# EAGLE schematic cut (EAGLE 4.11)
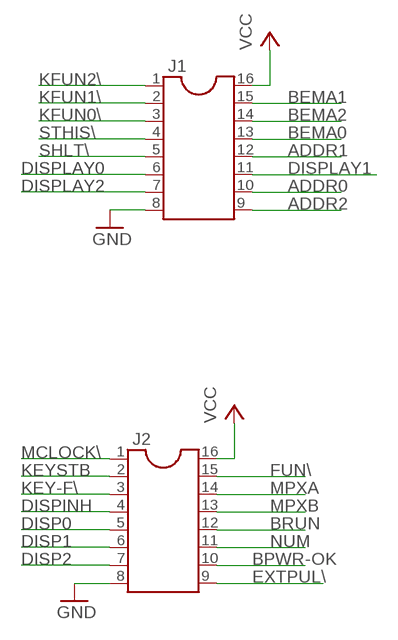
[diagram p0: schematic, sheet 1]

## Parts
J1  DIL16S  [SOCKED-16]
J2  DIL16S  [SOCKED-16]

## Nets
ADDR0: J1.10
ADDR1: J1.12
ADDR2: J1.9
BEMA0: J1.13
BEMA1: J1.15
BEMA2: J1.14
BPWR-OK: J2.10
BRUN: J2.12
DISP0: J2.5
DISP1: J2.6
DISP2: J2.7
DISPINH: J2.4
DISPLAY0: J1.6
DISPLAY1: J1.11
DISPLAY2: J1.7
EXTPUL\: J2.9
FUN\: J2.15
GND: J1.8 J2.8
KEY-F\: J2.3
KEYSTB: J2.2
KFUN0\: J1.3
KFUN1\: J1.2
KFUN2\: J1.1
MCLOCK\: J2.1
MPXA: J2.14
MPXB: J2.13
NUM: J2.11
SHLT\: J1.5
STHIS\: J1.4
VCC: J1.16 J2.16

## Library data of the parts
J1 J2 = ic-package:DIL16: Dual In Line